# EAGLE design LaserSupply (EAGLE 7.5.0)
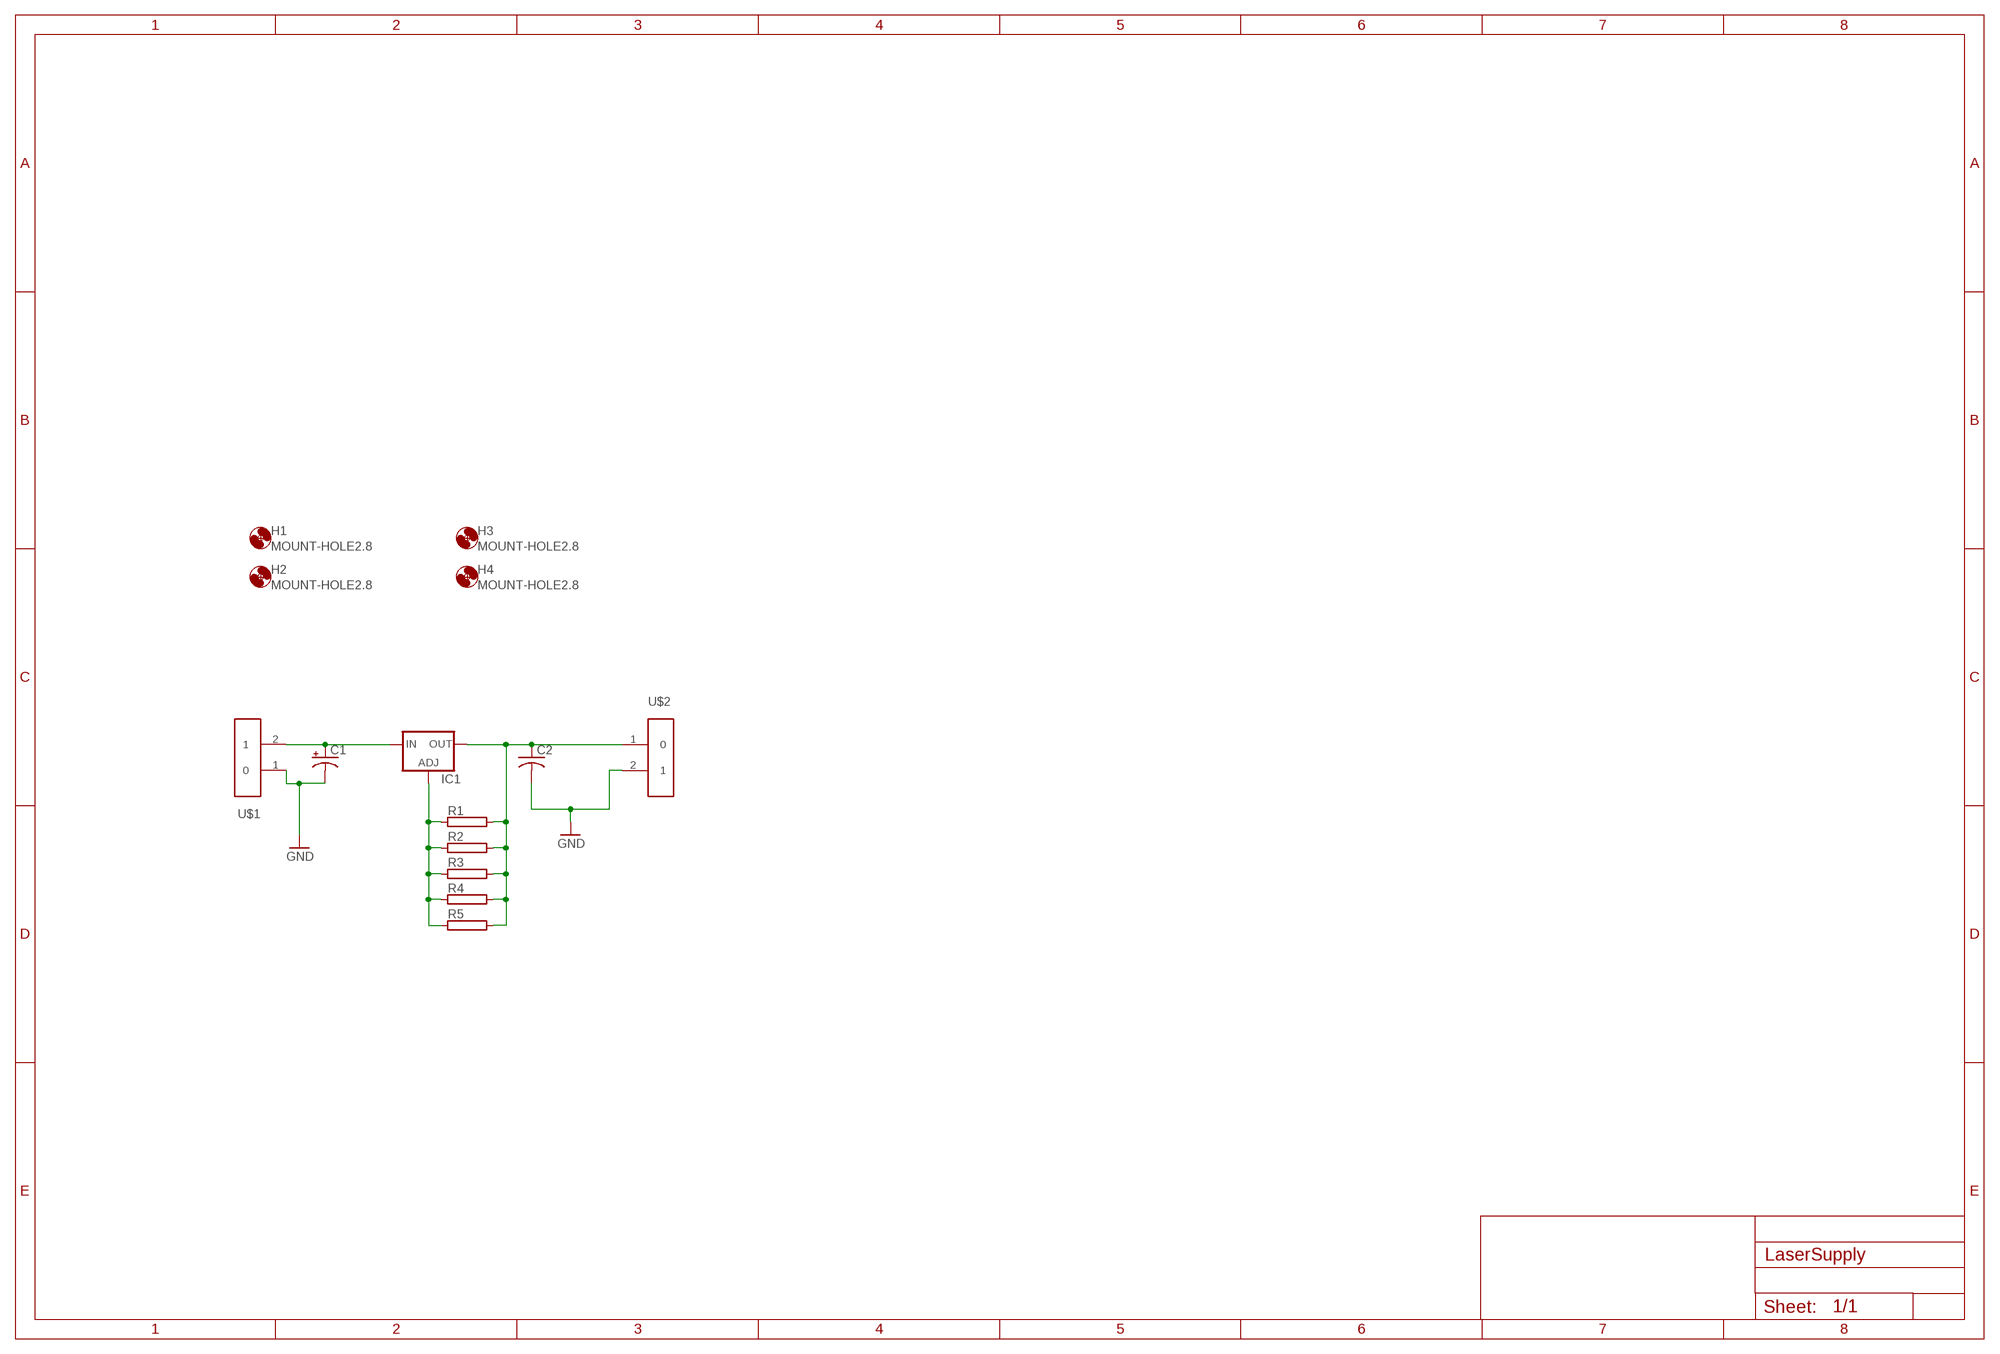
[diagram p0: schematic, sheet 1]

## Parts
C1  CPOL-USE2.5-5  [E2,5-5]
C2  C-US050-024X044  [C050-024X044]
H1  MOUNT-HOLE2.8  [2,8]
H2  MOUNT-HOLE2.8  [2,8]
H3  MOUNT-HOLE2.8  [2,8]
H4  MOUNT-HOLE2.8  [2,8]
IC1  LM317TS  [317TS]
R1  RRS1/4  [RS1/4]
R2  RRS1/4  [RS1/4]
R3  RRS1/4  [RS1/4]
R4  RRS1/4  [RS1/4]
R5  RRS1/4  [RS1/4]
U$1  ED2609  [ED2609]
U$2  ED2609  [ED2609]

## Nets
GND: C1.- C2.2 U$1.1 U$2.2
N$1: C1.+ IC1.3(IN) U$1.2
N$2: IC1.1(ADJ) R1.1 R2.1 R3.1 R4.1 R5.1
N$3: C2.1 IC1.2(OUT) R1.2 R2.2 R3.2 R4.2 R5.2 U$2.1

## Library data of the parts
C1 = rcl:CPOL-US: POLARIZED CAPACITOR, American symbol
C2 = rcl:C-US: CAPACITOR, American symbol
H1-H4 = holes:MOUNT-HOLE: MOUNTING HOLE with drill center marker
IC1 = v-reg:LM317TS: VOLTAGE REGULATOR
R1-R5 = resistor-power:R: Power Resitor; MF: OHMITE; MPN: RRS1K0; OC_FARNELL: unknown; OC_NEWARK: 01F7661
U$1 U$2 = slicer:ED2609

## Board
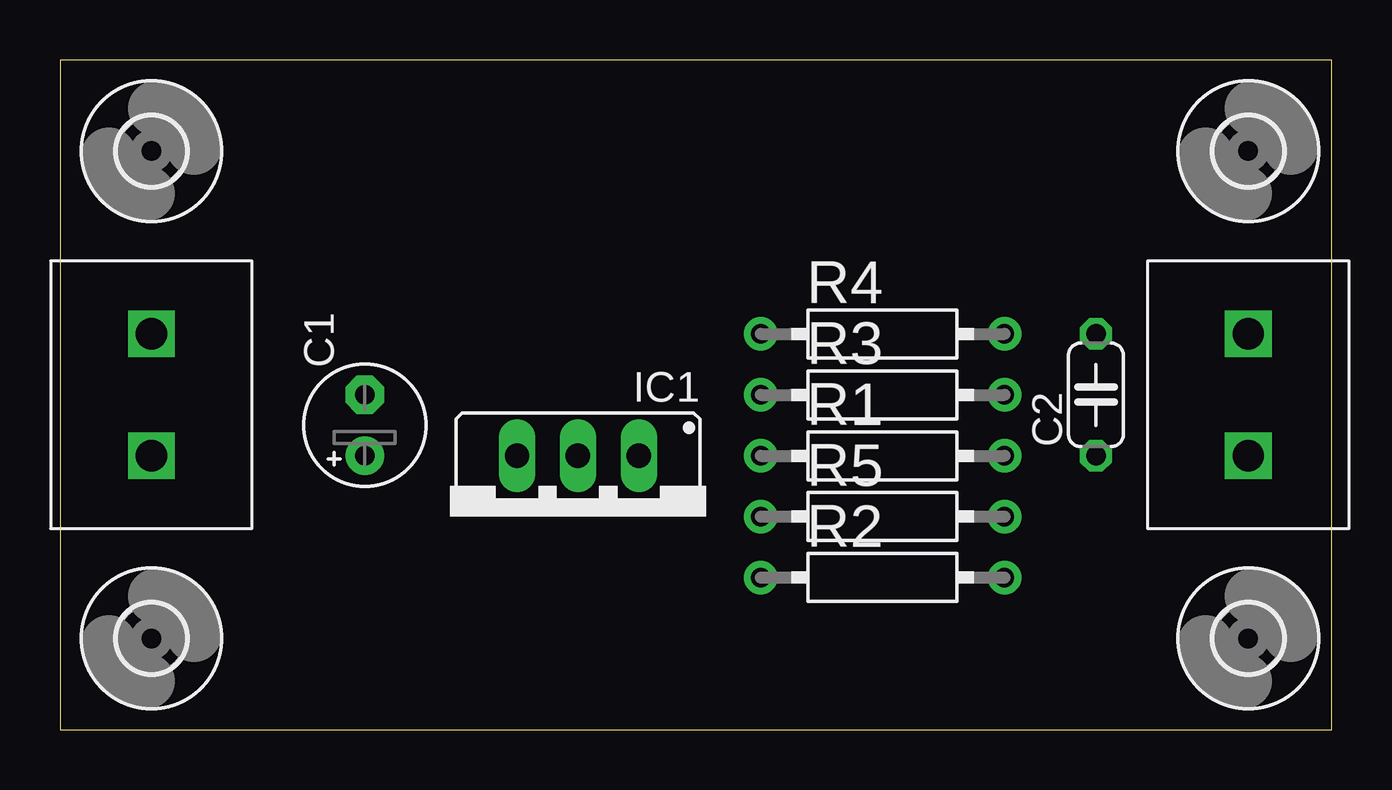
[diagram p1: board, top side]
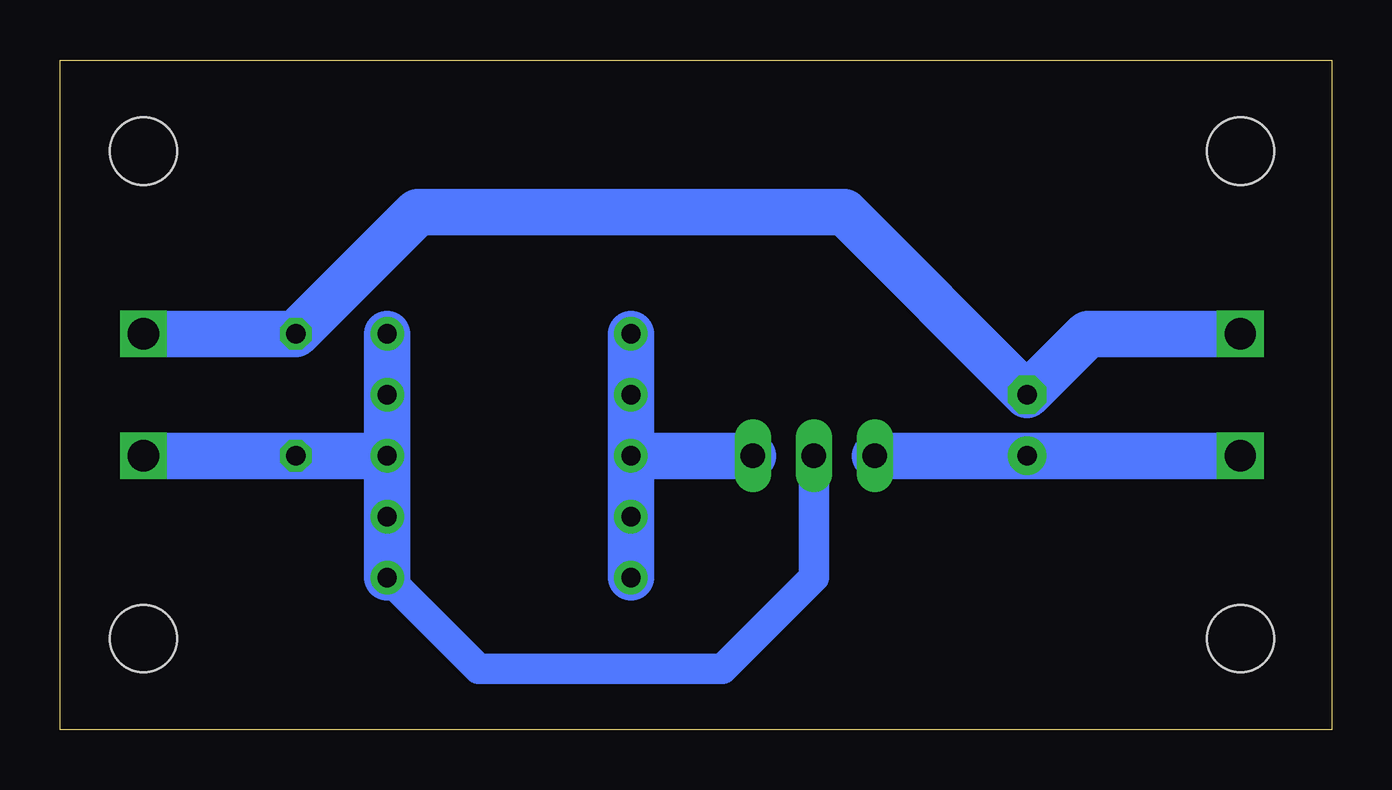
[diagram p2: board, bottom side, seen from below]

Size 53.01 x 27.93 mm. Coordinates in mm from the lower left corner, seen from the top.
Outline: 0,0 53.01,0 53.01,27.93 0,27.93 0,0
Copper layers (1*16): Top 0.035mm / dielectric 1.5mm / Bottom 0.035mm
Design rules "default": minimum track width 10mil, minimum drill 24mil, track to track 8mil, track to pad 8mil, pad to pad 8mil, via to via 8mil, smd to smd 8mil, copper to edge 40mil, drill to drill 8mil, minimum pad ring 10mil, minimum via ring 8mil, stop-mask expansion 4mil, vias tented up to drill 0mil, thermal gap 10mil

### Footprints (pad centres in the part's own frame; a part is rotated, then mirrored left to right if it is on the bottom)
E2,5-5 = drill 0.813 pad 1.6: + -1.27,0 | drill 0.813 pad 1.6 octagon: - 1.27,0
C050-024X044 = drill 0.813 octagon: 1 -2.54,0; 2 2.54,0
2,8 = hole 2.8: 0,0
317TS = drill 1.016 long: 1 -2.54,-2.54; 2 0,-2.54; 3 2.54,-2.54
RS1/4 = drill 0.8 pad 1.4: 1 -5.08,0; 2 5.08,0
ED2609 = drill 1.3 square: 1 0,0; 2 5.08,0

### Placement (x,y rotation side)
C1  12.7,12.7 90 top
C2  43.18,13.97 90 top
H1  49.53,24.13 0 top
H2  49.53,3.81 0 top
H3  3.81,3.81 0 top
H4  3.81,24.13 0 top
IC1  21.59,8.89 180 top
R1  34.29,11.43 0 top
R2  34.29,6.35 0 top
R3  34.29,13.97 0 top
R4  34.29,16.51 0 top
R5  34.29,8.89 0 top
U$1  3.81,16.51 270 top
U$2  49.53,11.43 90 top

### Tracks (layer width: path | path; a pad name or v marks a point on that pad's centre or on a via)
GND
  Bottom 1.93: U$1.1 10.16,16.51 C1.- 20.32,21.59 38.1,21.59 C2.2 U$2.2
N$1
  Bottom 1.93: U$1.2 C1.+ IC1.3
N$2
  Bottom 1.93: R4.1 R3.1 R1.1 | R1.1 R5.1 R2.1 | IC1.1 R1.1
N$3
  Bottom 1.27: IC1.2 21.59,6.35 25.4,2.54 35.56,2.54 R2.2
  Bottom 1.93: R4.2 R3.2 R1.2 | R1.2 C2.1 U$2.1 | R1.2 R5.2 R2.2